# Altium schematic sheet 06_GPRS.SchDoc
size A3
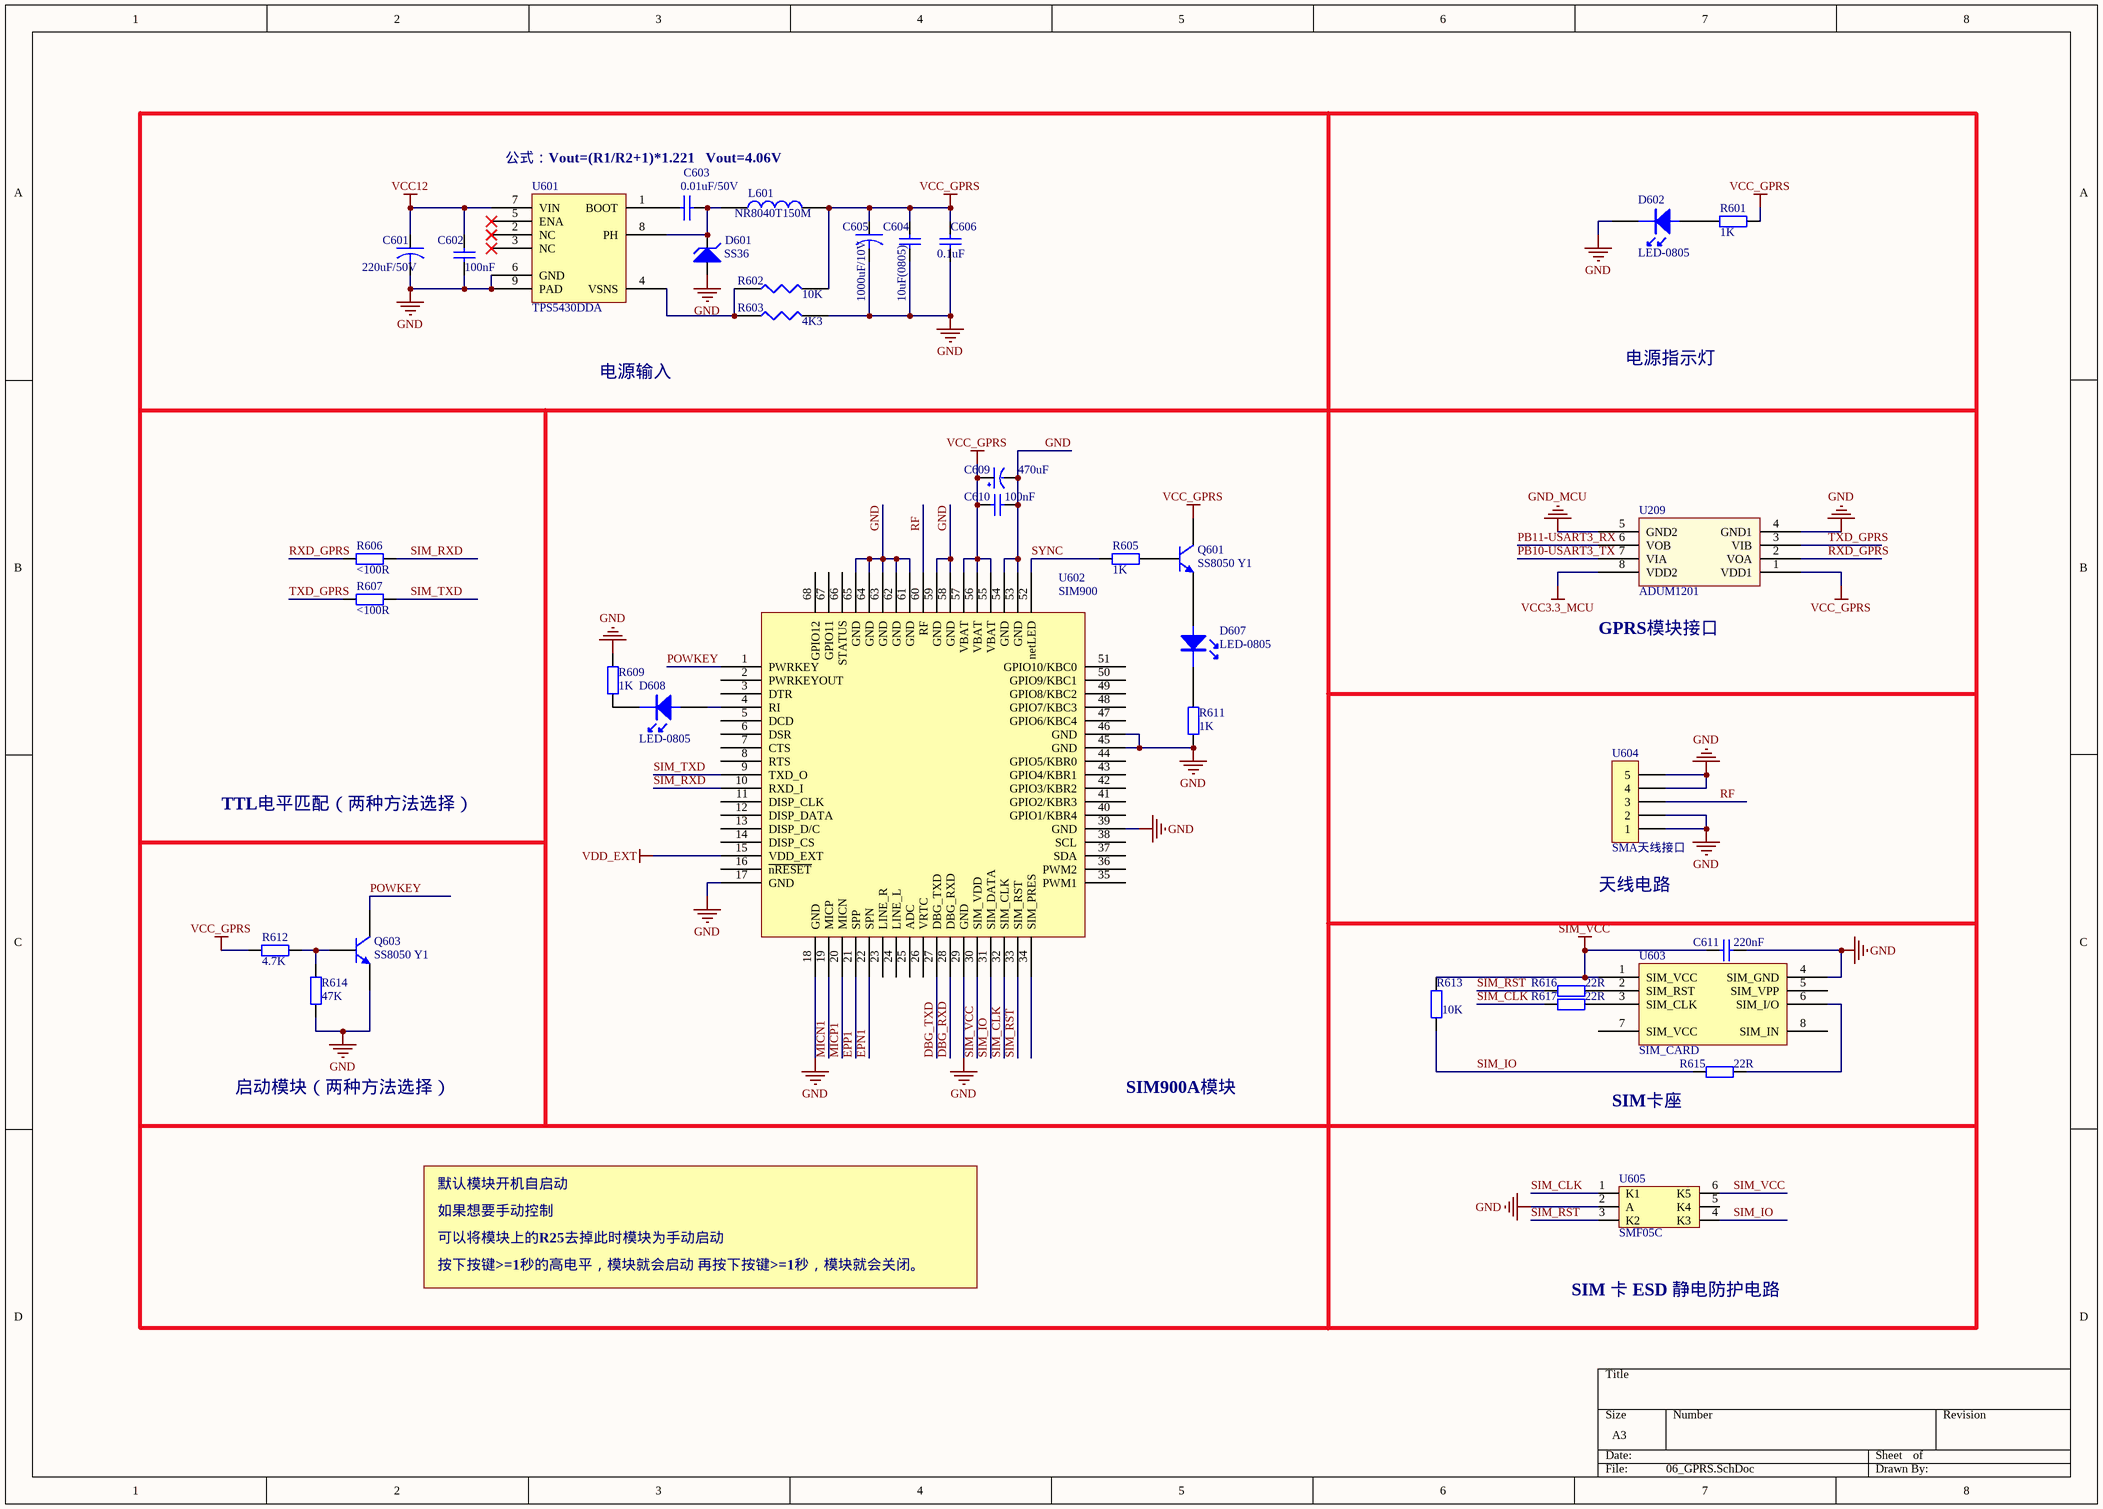
[diagram p0: 06_GPRS.SchDoc]

## Parts
C601  220uF/50V  [RB050-100]
C602  100nF  [0805C]
C603  0.01uF/50V  [0603C]
C604  10uF(0805)  [LC-0603_C]
C605  1000uF/10V  [RB035-080]
C606  0.1uF  [LC-0603_C]
C609  470uF  [CAP_10*10]
C610  100nF  [LC-0603_C]
C611  220nF  [LC-0603_C]
D601  SS36  [D1812]
D602  LED-0805  [0805LED]
D607  LED-0805  [0805LED]
D608  LED-0805  [0805LED]
L601  NR8040T150M  [NR8040]
Q601  SS8050 Y1  [LC-SOT-23(SOT-23-3)]
Q603  SS8050 Y1  [LC-SOT-23(SOT-23-3)]
R601  1K  [LC-0603_R]
R602  10K  [0603R]
R603  4K3  [0603R]
R605  1K  [LC-0603_R]
R606  <100R  [LC-0603_R]
R607  <100R  [LC-0603_R]
R609  1K  [LC-0603_R]
R611  1K  [LC-0603_R]
R612  4.7K  [LC-0603_R]
R613  10K  [LC-0603_R]
R614  47K  [LC-0603_R]
R615  22R  [LC-0603_R]
R616  22R  [LC-0603_R]
R617  22R  [LC-0603_R]
U209  ADUM1201  [SOP_8]
U601  TPS5430DDA  [SO-G8]
U602  SIM900  [GSM_900A]
U603  SIM_CARD  [MICRO SIM6]
U604  SMA天线接口  [RF_2]
U605  SMF05C  [SOT-363]

## Nets
GND: C601.2 C602.2 C604.2 C605.2 C606.1 C609.2(GND) C610.2 C611.2 D601.1(A) D602.1(-) Q603.2(E) R603.2 R609.2 R611.2 R614.1 U209.4(GND1) U601.6(GND) U601.9(PAD) U602.17(GND) U602.18(GND) U602.29(GND) U602.39(GND) U602.45(GND) U602.46(GND) U602.53(GND) U602.54(GND) U602.58(GND) U602.59(GND) U602.61(GND) U602.62(GND) U602.63(GND) U602.64(GND) U602.65(GND) U603.4(SIM_GND) U604.1 U604.2 U604.4 U604.5 U605.2(A)
GND_MCU: U209.5(GND2)
SIM_VCC: C611.1 R613.2 U602.30(SIM_VDD) U603.1(SIM_VCC) U605.6(K5)
VCC3.3_MCU: U209.8(VDD2)
VCC12: C601.1 C602.1 U601.7(VIN)
VCC_GPRS: C604.1 C605.1 C606.2 C609.1(VCC) C610.1 L601.2 Q601.3(C) R601.1 R602.2 R612.1 U209.1(VDD1) U602.55(VBAT) U602.56(VBAT) U602.57(VBAT)
VDD_EXT: U602.15(VDD_EXT)
DBG_RXD: U602.28(DBG_RXD)
DBG_TXD: U602.27(DBG_TXD)
EPN1: U602.22(SPN)
EPP1: U602.21(SPP)
MICN1: U602.19(MICP)
MICP1: U602.20(MICN)
PB10-USART3_TX: U209.7(VIA)
PB11-USART3_RX: U209.6(VOB)
POWKEY: Q603.3(C) U602.1(PWRKEY)
RF: U602.60(RF) U604.3
RXD_GPRS: R606.1 U209.2(VOA)
SIM_CLK: R617.2 U602.32(SIM_CLK) U605.1(K1)
SIM_IO: R613.1 R615.2 U602.31(SIM_DATA) U605.4(K3)
SIM_RST: R616.2 U602.33(SIM_RST) U605.3(K2)
SIM_RXD: R606.2 U602.10(RXD_I)
SIM_TXD: R607.2 U602.9(TXD_O)
SYNC: R605.2 U602.52(netLED)
TXD_GPRS: R607.1 U209.3(VIB)
NetC603_1: C603.1 U601.1(BOOT)
NetC603_2: C603.2 D601.2(K) L601.1 U601.8(PH)
NetD602_2: D602.2(+) R601.2
NetD607_1: D607.1(-) R611.1
NetD607_2: D607.2(+) Q601.2(E)
NetD608_1: D608.1(-) R609.1
NetD608_2: D608.2(+) U602.4(RI)
NetQ601_1: Q601.1(B) R605.1
NetQ603_1: Q603.1(B) R612.2 R614.2
NetR602_1: R602.1 R603.1 U601.4(VSNS)
NetR615_1: R615.1 U603.6(SIM_I/O)
NetR616_1: R616.1 U603.2(SIM_RST)
NetR617_1: R617.1 U603.3(SIM_CLK)

Not connected (* = marked no-connect by the designer): U601 2(NC)* 3(NC)* 5(ENA)*; U602 2(PWRKEYOUT) 3(DTR) 5(DCD) 6(DSR) 7(CTS) 8(RTS) 11(DISP_CLK) 12(DISP_DATA) 13(DISP_D/C) 14(DISP_CS) 16(~{nRESET}) 23(LINE_R) 24(LINE_L) 25(ADC) 26(VRTC) 34(SIM_PRES) 35(PWM1) 36(PWM2) 37(SDA) 38(SCL) 40(GPIO1/KBR4) 41(GPIO2/KBR3) 42(GPIO3/KBR2) 43(GPIO4/KBR1) 44(GPIO5/KBR0) 47(GPIO6/KBC4) 48(GPIO7/KBC3) 49(GPIO8/KBC2) 50(GPIO9/KBC1) 51(GPIO10/KBC0) 66(STATUS) 67(GPIO11) 68(GPIO12); U603 5(SIM_VPP) 7(SIM_VCC) 8(SIM_IN); U605 5(K4)

## Notes on the sheet
- 公式：Vout=(R1/R2+1)*1.221   Vout=4.06V
- 电源输入
- 电源指示灯
- (near U209) GPRS模块接口
- TTL电平匹配（两种方法选择）
- (near U604) 天线电路
- 启动模块（两种方法选择）
- SIM900A模块
- SIM卡座
- 默认模块开机自启动
- 如果想要手动控制
- 可以将模块上的R25去掉此时模块为手动启动
- 按下按键>=1秒的高电平，模块就会启动 再按下按键>=1秒，模块就会关闭。
- SIM 卡 ESD 静电防护电路

## Library data of the parts
C601 C605 = CAPACITOR
C602 C604 C610 C611 = 0603 1uF (105) 10% 50V: 贴片电容; ComponentLink1Description: 供应商链接; ComponentLink1URL: http://www.szlcsc.com/product/details_16531.html; Package: 0603; Supplier: LC; SuppliersPartNumber: C15849
C603 = CAP: Capacitor
C606 = 0603 1.0pF (010) 0.25pF 50V: 贴片电容; ComponentLink1Description: 供应商链接; ComponentLink1URL: http://www.szlcsc.com/product/details_24709.html; Package: 0603; Supplier: LC; SuppliersPartNumber: C23969
C609 = CAP
D601 = SS36: Zener Diode
D602 D607 D608 = LED_SMD: 贴片LED
L601 = INDUCTOR
Q601 Q603 = SOT-23 SS8050 Y1: 三极管; ComponentLink1Description: 供应商链接; ComponentLink1URL: http://www.szlcsc.com/product/details_2507.html; Package: SOT-23; Supplier: LC; SuppliersPartNumber: C2150
R601 R605-R607 R609 R611-R617 = 0603 2KΩ (2001) 1%: 贴片电阻; ComponentLink1Description: 供应商链接; ComponentLink1URL: http://www.szlcsc.com/product/details_23702.html; Package: 0603; Supplier: LC; SuppliersPartNumber: C22975
R602 R603 = RES1
U209 = ADUM1201: 串口隔离
U603 = SIM_CARD: SIM中卡卡槽
U604 = CON5: Connector
U605 = SMF05C: TVS